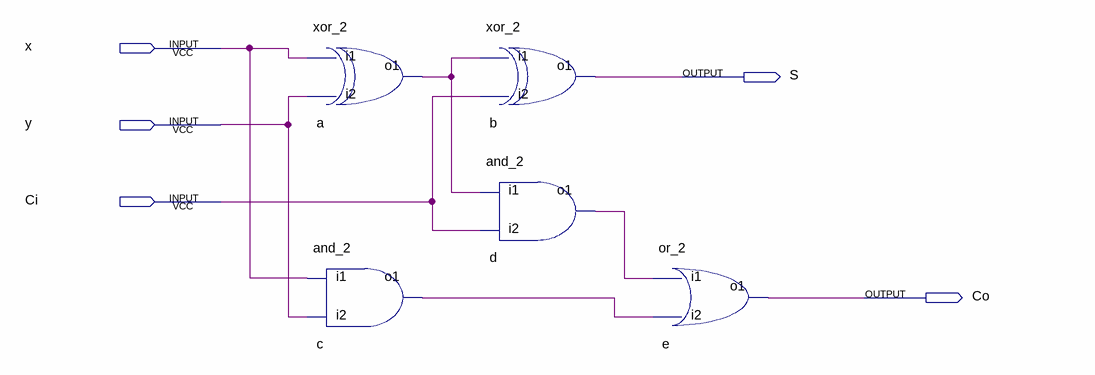
[diagram p0: schematic sheet]
// Quartus schematic FA.bdf as structural Verilog: 5 symbols, 5 pins
module FA (
  input  x,
  input  y,
  input  Ci,
  output S,
  output Co
);

  wire a_o1, c_o1, d_o1;

  xor_2 a (.i1(x), .i2(y), .o1(a_o1));
  and_2 c (.i1(x), .i2(y), .o1(c_o1));
  xor_2 b (.i1(a_o1), .i2(Ci), .o1(S));
  and_2 d (.i1(a_o1), .i2(Ci), .o1(d_o1));
  or_2 e (.i1(d_o1), .i2(c_o1), .o1(Co));
endmodule
